# EAGLE schematic master (EAGLE 7.6.0)

## Sheet 1 of 2
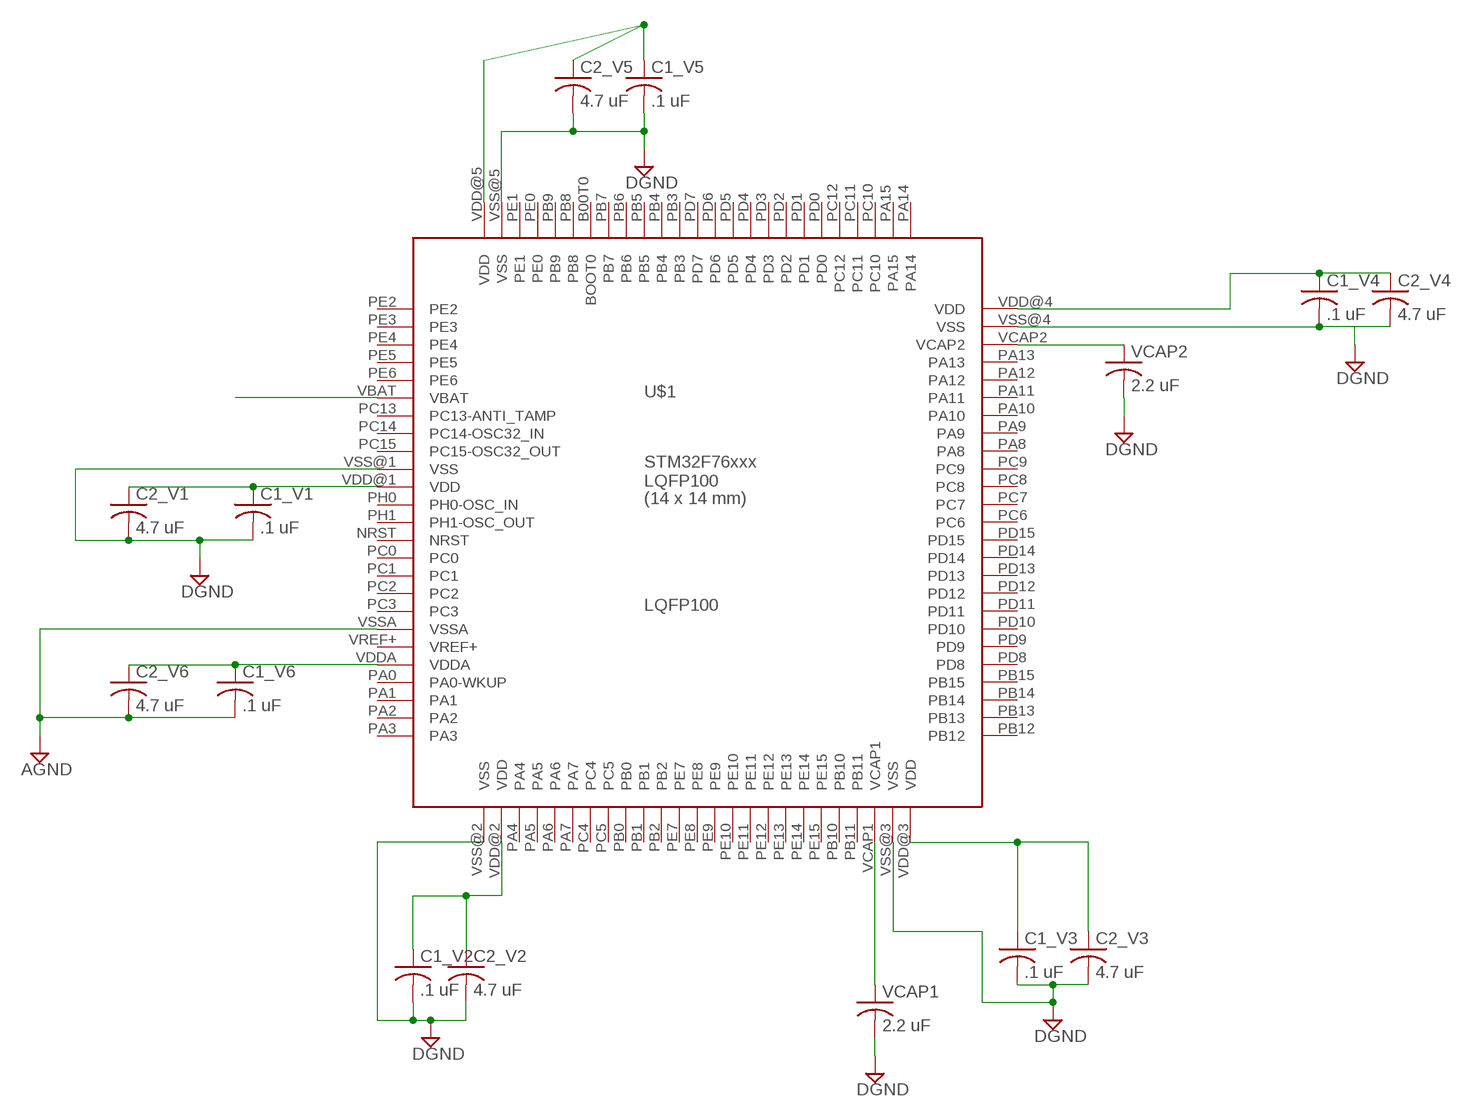
[diagram p0: schematic, sheet 1]

### Parts
C1_V1  .1 uF  C-USC1206  [C1206]
C1_V2  .1 uF  C-USC1206  [C1206]
C1_V3  .1 uF  C-USC1206  [C1206]
C1_V4  .1 uF  C-USC1206  [C1206]
C1_V5  .1 uF  C-USC1206  [C1206]
C1_V6  .1 uF  C-USC1206  [C1206]
C2_V1  4.7 uF  C-USC1206  [C1206]
C2_V2  4.7 uF  C-USC1206  [C1206]
C2_V3  4.7 uF  C-USC1206  [C1206]
C2_V4  4.7 uF  C-USC1206  [C1206]
C2_V5  4.7 uF  C-USC1206  [C1206]
C2_V6  4.7 uF  C-USC1206  [C1206]
U$1  LQFP100  [LQFP100]
VCAP1  2.2 uF  C-USC1206  [C1206]
VCAP2  2.2 uF  C-USC1206  [C1206]

### Nets
AGND: C1_V6.2 C2_V6.2 U$1.VSSA
DGND: C1_V1.2 C1_V2.2 C1_V3.2 C1_V5.2 C2_V1.2 C2_V2.2 C2_V3.2 C2_V5.2 U$1.VSS@1(VSS) U$1.VSS@2(VSS) U$1.VSS@3(VSS) U$1.VSS@5(VSS) VCAP1.2 VCAP2.2
N$1: U$1.VCAP1 VCAP1.1
N$2: U$1.VCAP2 VCAP2.1
N$3: C1_V6.1 C2_V6.1 U$1.VDDA
N$4: C1_V3.1 C2_V3.1 U$1.VDD@3(VDD)
N$5: C1_V2.1 C2_V2.1 U$1.VDD@2(VDD)
N$7: C1_V4.1 C2_V4.1 U$1.VDD@4(VDD)
N$8: C1_V4.2 C2_V4.2 U$1.VSS@4(VSS)
N$11: C1_V1.1 C2_V1.1 U$1.VDD@1(VDD)
N$13: C1_V5.1 C2_V5.1 U$1.VDD@5(VDD)
N$17: U$1.VBAT
Unconnected: U$1.B00T0(BOOT0) U$1.NRST U$1.PA0(PA0-WKUP) U$1.PA1 U$1.PA2 U$1.PA3 U$1.PA4 U$1.PA5 U$1.PA6 U$1.PA7 U$1.PA8 U$1.PA9 U$1.PA10 U$1.PA11 U$1.PA12 U$1.PA13 U$1.PA14 U$1.PA15 U$1.PB0 U$1.PB1 U$1.PB2 U$1.PB3 U$1.PB4 U$1.PB5 U$1.PB6 U$1.PB7 U$1.PB8 U$1.PB9 U$1.PB10 U$1.PB11 U$1.PB12 U$1.PB13 U$1.PB14 U$1.PB15 U$1.PC0 U$1.PC1 U$1.PC2 U$1.PC3 U$1.PC4 U$1.PC5 U$1.PC6 U$1.PC7 U$1.PC8 U$1.PC9 U$1.PC10 U$1.PC11 U$1.PC12 U$1.PC13(PC13-ANTI_TAMP) U$1.PC14(PC14-OSC32_IN) U$1.PC15(PC15-OSC32_OUT) U$1.PD0 U$1.PD1 U$1.PD2 U$1.PD3 U$1.PD4 U$1.PD5 U$1.PD6 U$1.PD7 U$1.PD8 U$1.PD9 U$1.PD10 U$1.PD11 U$1.PD12 U$1.PD13 U$1.PD14 U$1.PD15 U$1.PE0 U$1.PE1 U$1.PE2 U$1.PE3 U$1.PE4 U$1.PE5 U$1.PE6 U$1.PE7 U$1.PE8 U$1.PE9 U$1.PE10 U$1.PE11 U$1.PE12 U$1.PE13 U$1.PE14 U$1.PE15 U$1.PH0(PH0-OSC_IN) U$1.PH1(PH1-OSC_OUT) U$1.VREF+

## Sheet 2 of 2
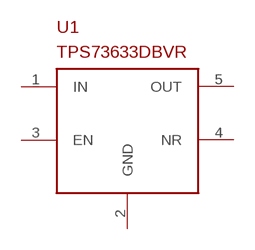
[diagram p1: schematic, sheet 2]

### Parts
U1  TPS73633DBVR  [SOT23-DBV]
Unconnected: U1.1(IN) U1.2(GND) U1.3(EN) U1.4(NR) U1.5(OUT)

## Library data of the parts
C1_V1-C1_V6 C2_V1-C2_V6 VCAP1 VCAP2 = rcl:C-US: CAPACITOR, American symbol
U1 = TPS73633DBVR:TPS73633DBVR: 3.3V LDO regulator. Package footprint not verified!!; AVAILABILITY: Good; DESCRIPTION: Single Output LDO, 400mA, Adj.(1.2 to 5.5V), Cap free, Low Noise, Reverse Current Protection 5-SOT-23 -40 to 125; MF: Texas Instruments; MP: TPS73633DBVR; PACKAGE: SOT-23 Texas Instruments; PRICE: 1.34 USD
U$1 = stmc7:LQFP100